# EAGLE schematic External Diagram FSAE 2021 (EAGLE 9.6.2)
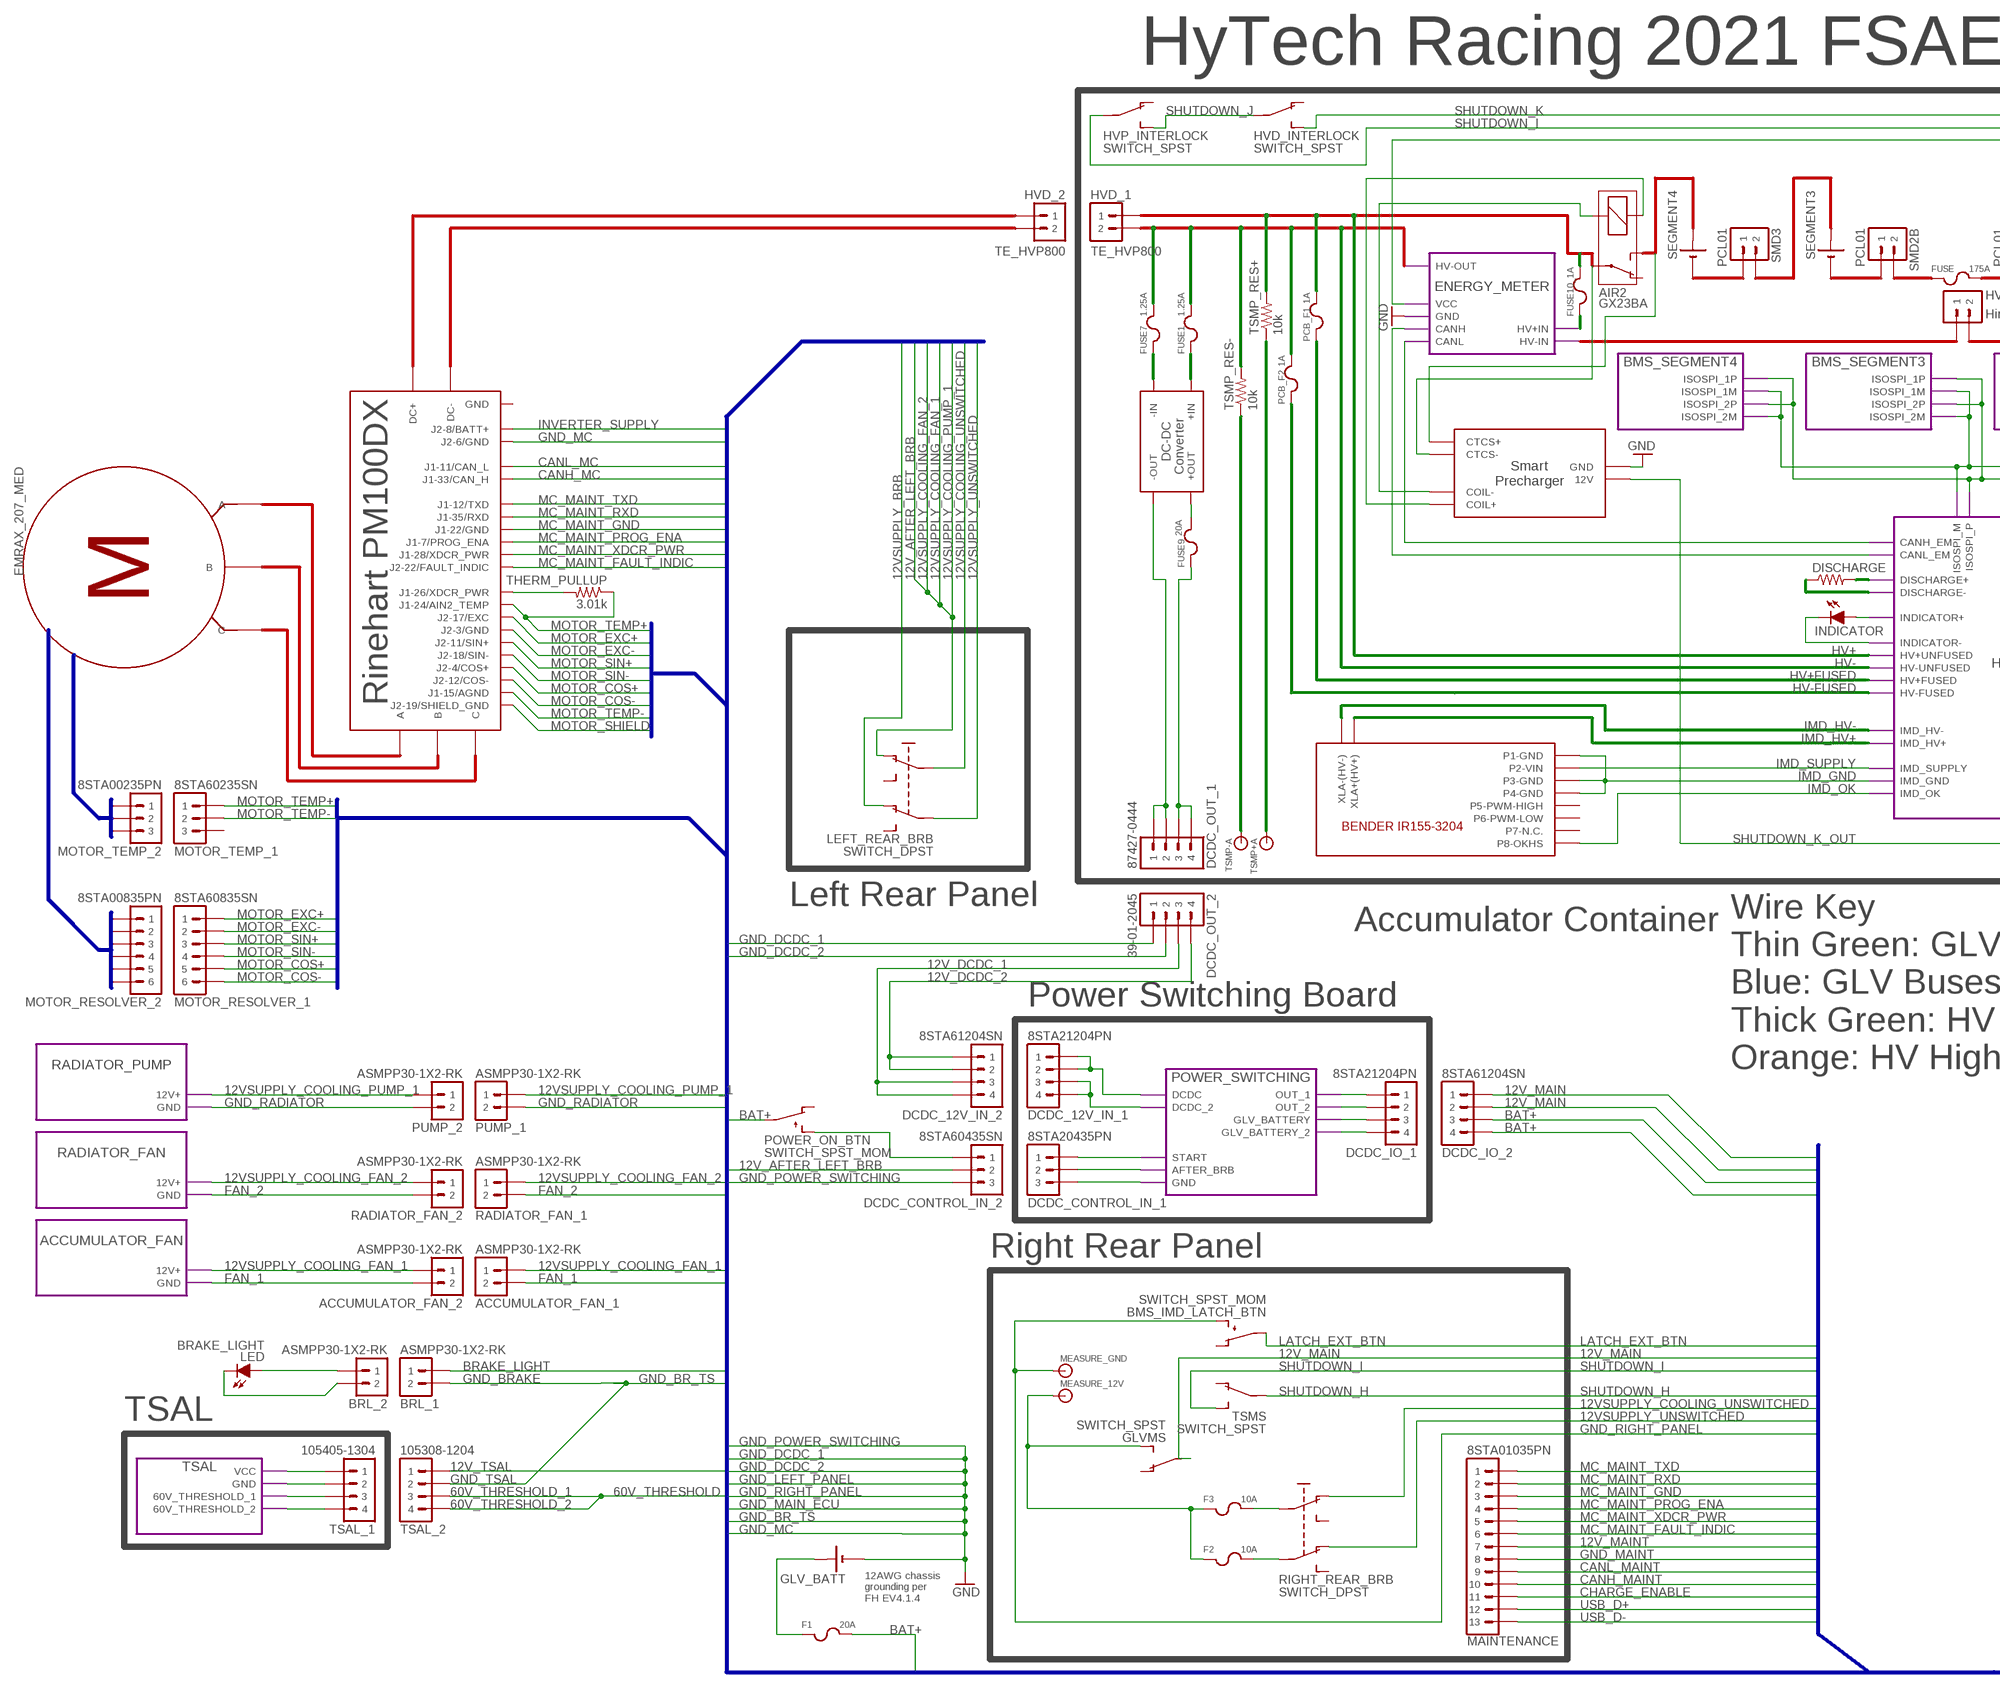
[diagram p0: schematic, sheet 1, part 1 of 2]
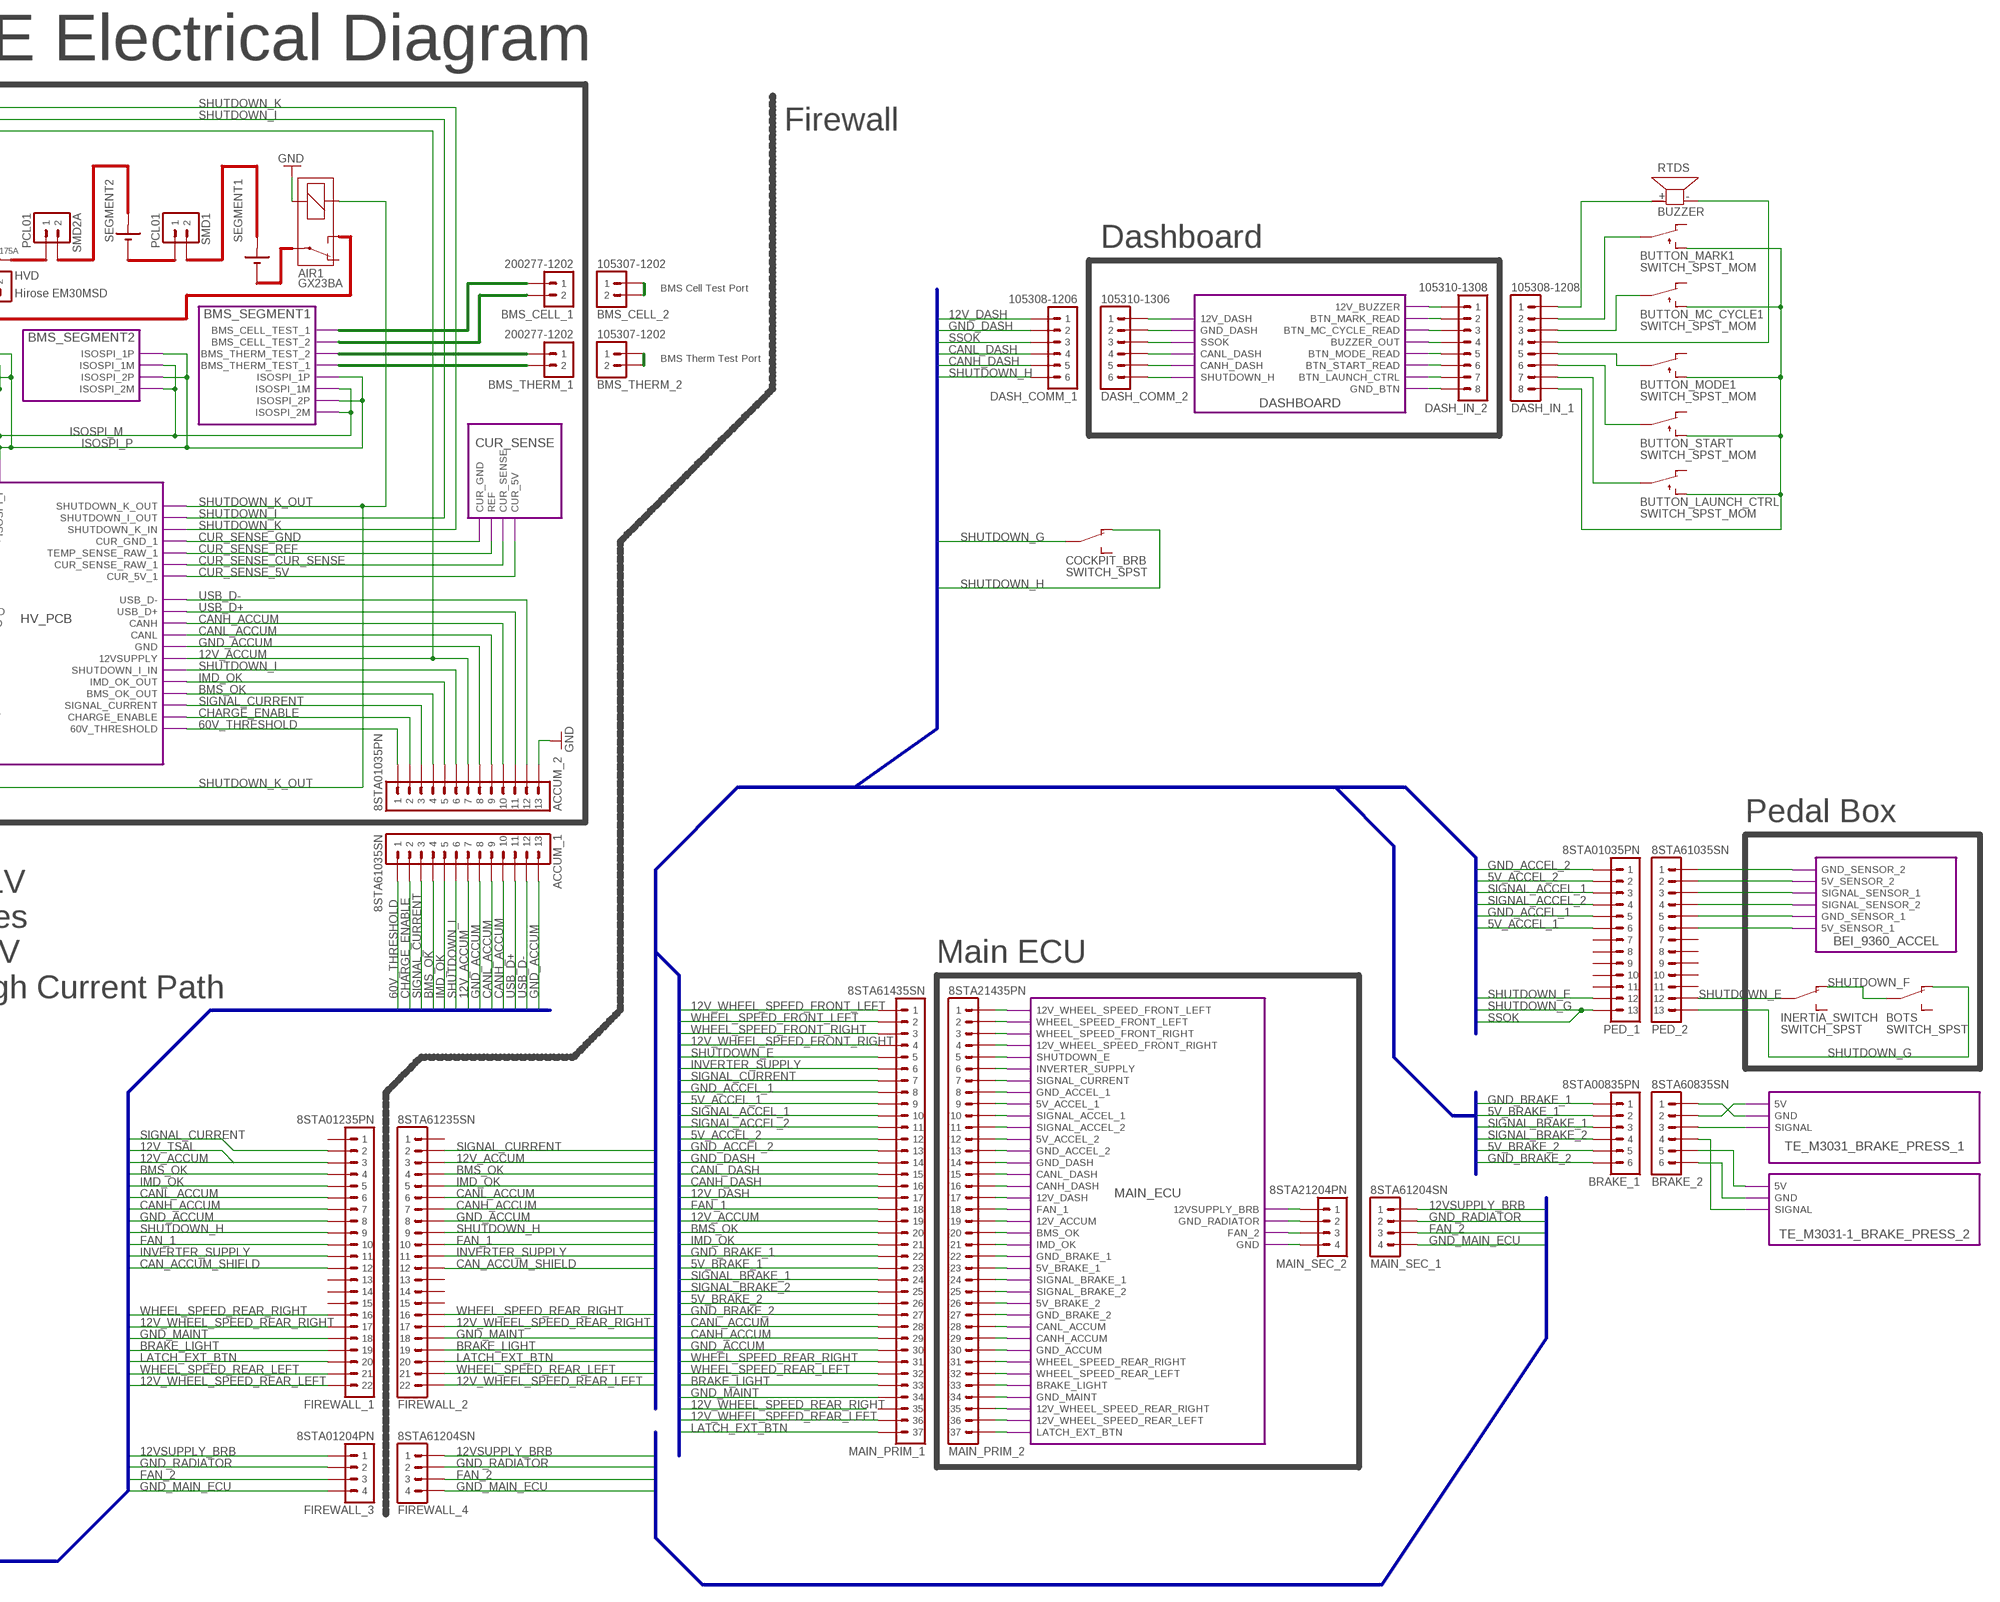
[diagram p1: schematic, sheet 1, part 2 of 2]

## Parts
ACCUM_1  8STA61035SN  M13  (no package)
ACCUM_2  8STA01035PN  M13  (no package)
ACCUMULATOR_FAN_1  ASMPP30-1X2-RK  M02  (no package)
ACCUMULATOR_FAN_2  ASMPP30-1X2-RK  M02  (no package)
AIR1  GX23BA  RELAY  (no package)
AIR2  GX23BA  RELAY  (no package)
BMS_CELL_1  200277-1202  M02  (no package)
BMS_CELL_2  105307-1202  M02  (no package)
BMS_IMD_LATCH_BTN  SWITCH_SPST_MOM  (no package)
BMS_THERM_1  200277-1202  M02  (no package)
BMS_THERM_2  105307-1202  M02  (no package)
BOTS  SWITCH_SPST  (no package)
BRAKE_1  8STA00835PN  M06  (no package)
BRAKE_2  8STA60835SN  M06  (no package)
BRAKE_LIGHT  LED  (no package)
BRL_1  ASMPP30-1X2-RK  M02  (no package)
BRL_2  ASMPP30-1X2-RK  M02  (no package)
BUTTON_LAUNCH_CTRL  SWITCH_SPST_MOM  (no package)
BUTTON_MARK1  SWITCH_SPST_MOM  (no package)
BUTTON_MC_CYCLE1  SWITCH_SPST_MOM  (no package)
BUTTON_MODE1  SWITCH_SPST_MOM  (no package)
BUTTON_START  SWITCH_SPST_MOM  (no package)
COCKPIT_BRB  SWITCH_SPST  (no package)
DASH_COMM_1  105308-1206  M06  (no package)
DASH_COMM_2  105310-1306  M06  (no package)
DASH_IN_1  105308-1208  M08  (no package)
DASH_IN_2  105310-1308  M08  (no package)
DCDC_12V_IN_1  8STA21204PN  M04  (no package)
DCDC_12V_IN_2  8STA61204SN  M04  (no package)
DCDC_CONTROL_IN_1  8STA20435PN  M03  (no package)
DCDC_CONTROL_IN_2  8STA60435SN  M03  (no package)
DCDC_IO_1  8STA21204PN  M04  (no package)
DCDC_IO_2  8STA61204SN  M04  (no package)
DCDC_OUT_1  87427-0444  M04  (no package)
DCDC_OUT_2  39-01-2045  M04  (no package)
DISCHARGE  RESISTOR10W  [10W_RESISTOR_VISHAY]
EMRAX_207_MED  MOTOR_AC  (no package)
F1  20A  FUSE  (no package)
F2  10A  FUSE  (no package)
F3  10A  FUSE  (no package)
FIREWALL_1  8STA01235PN  M22  (no package)
FIREWALL_2  8STA61235SN  M22  (no package)
FIREWALL_3  8STA01204PN  M04  (no package)
FIREWALL_4  8STA61204SN  M04  (no package)
FUSE  175A  FUSE  (no package)
FUSE1  1.25A  FUSE  (no package)
FUSE7  1.25A  FUSE  (no package)
FUSE9  20A  FUSE  (no package)
FUSE10_1A  FUSE  (no package)
GLV_BATT  BATTERY_1_CELL  (no package)
GLVMS  SWITCH_SPST  (no package)
HVD  Hirose EM30MSD  M02  (no package)
HVD_1  TE_HVP800  M02  (no package)
HVD_2  TE_HVP800  M02  (no package)
HVD_INTERLOCK  SWITCH_SPST  (no package)
HVP_INTERLOCK  SWITCH_SPST  (no package)
INDICATOR  INDICATOR  LED  (no package)
INERTIA_SWITCH  SWITCH_SPST  (no package)
LEFT_REAR_BRB  SWITCH_DPST  (no package)
MAIN_PRIM_1  8STA61435SN  M37  (no package)
MAIN_PRIM_2  8STA21435PN  M37  (no package)
MAIN_SEC_1  8STA61204SN  M04  (no package)
MAIN_SEC_2  8STA21204PN  M04  (no package)
MAINTENANCE  8STA01035PN  M13  (no package)
MEASURE_12V  BANANA_JACK  (no package)
MEASURE_GND  BANANA_JACK  (no package)
MOTOR_RESOLVER_1  8STA60835SN  M06  (no package)
MOTOR_RESOLVER_2  8STA00835PN  M06  (no package)
MOTOR_TEMP_1  8STA60235SN  M03  (no package)
MOTOR_TEMP_2  8STA00235PN  M03  (no package)
PCB_F1  1A  FUSE  (no package)
PCB_F2  1A  FUSE  (no package)
PED_1  8STA01035PN  M13  (no package)
PED_2  8STA61035SN  M13  (no package)
POWER_ON_BTN  SWITCH_SPST_MOM  (no package)
PUMP_1  ASMPP30-1X2-RK  M02  (no package)
PUMP_2  ASMPP30-1X2-RK  M02  (no package)
RADIATOR_FAN_1  ASMPP30-1X2-RK  M02  (no package)
RADIATOR_FAN_2  ASMPP30-1X2-RK  M02  (no package)
RIGHT_REAR_BRB  SWITCH_DPST  (no package)
RTDS  BUZZER  (no package)
SEGMENT1  BATTERY_1_CELL  (no package)
SEGMENT2  BATTERY_1_CELL  (no package)
SEGMENT3  BATTERY_1_CELL  (no package)
SEGMENT4  BATTERY_1_CELL  (no package)
SMD1  PCL01  M02  (no package)
SMD2A  PCL01  M02  (no package)
SMD2B  PCL01  M02  (no package)
SMD3  PCL01  M02  (no package)
THERM_PULLUP  3.01k  RESISTORAXIAL-0.3  [AXIAL-0.3]
TSAL_1  105405-1304  M04  (no package)
TSAL_2  105308-1204  M04  (no package)
TSMP+A  BANANA_JACK  (no package)
TSMP-A  BANANA_JACK  (no package)
TSMP_RES+  10k  RESISTOR10W  [10W_RESISTOR_VISHAY]
TSMP_RES-  10k  RESISTOR10W  [10W_RESISTOR_VISHAY]
TSMS  SWITCH_SPST  (no package)
U$1  RINEHART_PM100DX  (no package)
U$2  BENDER_IR155-3204  (no package)
U$3  SMART_PRECHARGER  (no package)
U$8  DC-DC_CONVERTER  (no package)

## Module instances
HV_PCB = HV_BOARD
BMS_SEGMENT2 = BMS_SEGMENT
BMS_SEGMENT3 = BMS_SEGMENT
BMS_SEGMENT4 = BMS_SEGMENT
RADIATOR_PUMP = COOLING_MODULE
RADIATOR_FAN = COOLING_MODULE
ACCUMULATOR_FAN = COOLING_MODULE
CUR_SENSE = CUR_SENSE
BMS_SEGMENT1 = BMS_SEGMENT_TEST
MAIN_ECU = MAIN_ECU
BEI_9360_ACCEL = BEI_9360
TE_M3031_BRAKE_PRESS_1 = TE_M3031
DASHBOARD = DASHBOARD
POWER_SWITCHING = POWER_SWITCHING
TE_M3031-1_BRAKE_PRESS_2 = TE_M3031
ENERGY_METER = ENERGY_METER
TSAL = TSAL

## Nets
5V_ACCEL_1: MAIN_PRIM_1.9 MAIN_PRIM_2.27 PED_1.6 PED_2.6 ; port MAIN_ECU.GND_BRAKE_2 BEI_9360_ACCEL.5V_SENSOR_1
5V_ACCEL_2: MAIN_PRIM_1.12 MAIN_PRIM_2.28 PED_1.2 PED_2.2 ; port MAIN_ECU.CANL_ACCUM BEI_9360_ACCEL.5V_SENSOR_2
5V_BRAKE: MAIN_PRIM_2.29 ; port MAIN_ECU.CANH_ACCUM
5V_BRAKE_1: BRAKE_1.2 MAIN_PRIM_1.23
5V_BRAKE_2: BRAKE_1.5 MAIN_PRIM_1.26
12V_ACCUM: ACCUM_1.7 ACCUM_2.7 FIREWALL_1.3 FIREWALL_2.3 MAIN_PRIM_1.19 MAIN_PRIM_2.10 ; port MAIN_ECU.SIGNAL_ACCEL_1 HV_PCB.12VSUPPLY ENERGY_METER.VCC
12V_AFTER_LEFT_BRB: DCDC_CONTROL_IN_2.2
12V_DASH: DASH_COMM_1.1 MAIN_PRIM_1.17 MAIN_PRIM_2.34 ; port MAIN_ECU.GND_MAINT
12V_DCDC_1: DCDC_12V_IN_2.3 DCDC_12V_IN_2.4 DCDC_OUT_2.3
12V_DCDC_2: DCDC_12V_IN_2.1 DCDC_12V_IN_2.2 DCDC_OUT_2.4
12V_MAIN: DCDC_IO_2.1 DCDC_IO_2.2 GLVMS.P
12V_MAINT: MAINTENANCE.7
12V_TSAL: TSAL_2.1
12V_WHEEL_SPEED_FRONT_LEFT: MAIN_PRIM_1.1
12V_WHEEL_SPEED_FRONT_RIGHT: MAIN_PRIM_1.4
12V_WHEEL_SPEED_REAR_LEFT: FIREWALL_1.22 FIREWALL_2.22 MAIN_PRIM_1.36
12V_WHEEL_SPEED_REAR_RIGHT: FIREWALL_1.17 FIREWALL_2.17
12VSUPPLY_BRB: FIREWALL_3.1 FIREWALL_4.1 LEFT_REAR_BRB.O1 MAIN_SEC_1.1 MAIN_SEC_2.1 ; port MAIN_ECU.12VSUPPLY_BRB
12VSUPPLY_COOLING_FAN_1: ACCUMULATOR_FAN_1.1 ACCUMULATOR_FAN_2.1 ; port ACCUMULATOR_FAN.12V+
12VSUPPLY_COOLING_FAN_2: RADIATOR_FAN_1.1 RADIATOR_FAN_2.1 ; port RADIATOR_FAN.12V+
12VSUPPLY_COOLING_PUMP_1: LEFT_REAR_BRB.O PUMP_1.1 PUMP_2.1 ; port RADIATOR_PUMP.12V+
12VSUPPLY_COOLING_UNSWITCHED: LEFT_REAR_BRB.P RIGHT_REAR_BRB.O
12VSUPPLY_UNSWITCHED: LEFT_REAR_BRB.P1 RIGHT_REAR_BRB.O1
60V_THRESHOLD: ACCUM_1.1 ACCUM_2.1 ; port HV_PCB.60V_THRESHOLD
60V_THRESHOLD_1: TSAL_2.3
60V_THRESHOLD_2: TSAL_2.4
BAT+: DCDC_IO_2.3 DCDC_IO_2.4 F1.2 POWER_ON_BTN.P
BMS_OK: ACCUM_1.4 ACCUM_2.4 FIREWALL_1.4 FIREWALL_2.4 MAIN_PRIM_1.20 ; port HV_PCB.BMS_OK_OUT
BRAKE_LIGHT: BRAKE_LIGHT.C BRL_1.1 BRL_2.2 FIREWALL_1.19 FIREWALL_2.19 MAIN_PRIM_1.33 MAIN_PRIM_2.9 MAIN_PRIM_2.33 ; port MAIN_ECU.5V_ACCEL_1 MAIN_ECU.BRAKE_LIGHT
CAN_ACCUM_SHIELD: FIREWALL_1.12 FIREWALL_2.12
CANH_ACCUM: ACCUM_1.10 ACCUM_2.10 FIREWALL_1.7 FIREWALL_2.7 MAIN_PRIM_1.29 MAIN_PRIM_2.13 ; port MAIN_ECU.GND_ACCEL_2 HV_PCB.CANH
CANH_DASH: DASH_COMM_1.5 MAIN_PRIM_1.16
CANH_MAINT: MAINTENANCE.10
CANH_MC: MAIN_PRIM_2.12 U$1.J1-33/CAN_H ; port MAIN_ECU.5V_ACCEL_2
CANL_ACCUM: ACCUM_1.9 ACCUM_2.9 FIREWALL_1.6 FIREWALL_2.6 MAIN_PRIM_1.28 MAIN_PRIM_2.26 ; port MAIN_ECU.5V_BRAKE_2 HV_PCB.CANL
CANL_DASH: DASH_COMM_1.4 MAIN_PRIM_1.15
CANL_MAINT: MAINTENANCE.9
CANL_MC: MAIN_PRIM_2.11 U$1.J1-11/CAN_L ; port MAIN_ECU.SIGNAL_ACCEL_2
CHARGE_ENABLE: ACCUM_1.2 ACCUM_2.2 MAINTENANCE.11 ; port HV_PCB.CHARGE_ENABLE
CUR_SENSE_5V: port CUR_SENSE.CUR_5V HV_PCB.CUR_5V_1
CUR_SENSE_CUR_SENSE: port CUR_SENSE.CUR_SENSE HV_PCB.CUR_SENSE_RAW_1
CUR_SENSE_GND: port CUR_SENSE.CUR_GND HV_PCB.CUR_GND_1
CUR_SENSE_REF: port CUR_SENSE.REF HV_PCB.TEMP_SENSE_RAW_1
DASH_1: MAIN_PRIM_2.1 ; port MAIN_ECU.12V_WHEEL_SPEED_FRONT_LEFT
DASH_4: MAIN_PRIM_2.4 ; port MAIN_ECU.12V_WHEEL_SPEED_FRONT_RIGHT
DASH_5: MAIN_PRIM_2.18 ; port MAIN_ECU.FAN_1
DASH_6: MAIN_PRIM_2.19 ; port MAIN_ECU.12V_ACCUM
DASH_8: MAIN_PRIM_2.21 ; port MAIN_ECU.IMD_OK
DASH_9: MAIN_PRIM_2.23 ; port MAIN_ECU.5V_BRAKE_1
DASH_11: MAIN_PRIM_2.6 ; port MAIN_ECU.INVERTER_SUPPLY
DASH_12: MAIN_PRIM_2.22 ; port MAIN_ECU.GND_BRAKE_1
FAN_1: ACCUMULATOR_FAN_1.2 ACCUMULATOR_FAN_2.2 FIREWALL_1.10 FIREWALL_2.10 MAIN_PRIM_1.18 ; port ACCUMULATOR_FAN.GND
FAN_2: FIREWALL_3.3 FIREWALL_4.3 MAIN_SEC_1.3 MAIN_SEC_2.3 RADIATOR_FAN_1.2 RADIATOR_FAN_2.2 ; port MAIN_ECU.FAN_2 RADIATOR_FAN.GND
GND: ACCUM_2.13 AIR1.2 MAIN_SEC_2.4 U$3.GND ; port MAIN_ECU.GND ENERGY_METER.GND
GND_ACCEL_1: MAIN_PRIM_1.8 MAIN_PRIM_2.14 PED_1.5 PED_2.5 ; port MAIN_ECU.GND_DASH BEI_9360_ACCEL.GND_SENSOR_1
GND_ACCEL_2: MAIN_PRIM_1.13 MAIN_PRIM_2.15 PED_1.1 PED_2.1 ; port MAIN_ECU.CANL_DASH BEI_9360_ACCEL.GND_SENSOR_2
GND_ACCUM: ACCUM_1.8 ACCUM_1.13 ACCUM_2.8 FIREWALL_1.8 FIREWALL_2.8 MAIN_PRIM_1.30 MAIN_PRIM_2.30 ; port MAIN_ECU.GND_ACCUM HV_PCB.GND
GND_AUX: MAIN_PRIM_2.36 ; port MAIN_ECU.12V_WHEEL_SPEED_REAR_LEFT
GND_BR: BRAKE_LIGHT.A BRL_2.1
GND_BRAKE: BRL_1.2 MAIN_PRIM_2.16 ; port MAIN_ECU.CANH_DASH
GND_BRAKE_1: BRAKE_1.1 MAIN_PRIM_1.22
GND_BRAKE_2: BRAKE_1.6 MAIN_PRIM_1.27
GND_CURRENT: MAIN_SEC_2.2 ; port MAIN_ECU.GND_RADIATOR
GND_DASH: DASH_COMM_1.2 MAIN_PRIM_1.14
GND_DCDC_1: DCDC_OUT_2.1
GND_DCDC_2: DCDC_OUT_2.2 GLV_BATT.- ; supply symbol labelled GND
GND_MAIN_ECU: FIREWALL_3.4 FIREWALL_4.4 MAIN_SEC_1.4
GND_MAINT: FIREWALL_1.18 FIREWALL_2.18 MAIN_PRIM_1.34 MAINTENANCE.8
GND_MC: U$1.J2-6/GND
GND_POWER_SWITCHING: DCDC_CONTROL_IN_2.3
GND_RADIATOR: FIREWALL_3.2 FIREWALL_4.2 MAIN_SEC_1.2 PUMP_1.2 PUMP_2.2 ; port RADIATOR_PUMP.GND
GND_RIGHT_PANEL: BMS_IMD_LATCH_BTN.S MEASURE_GND.1
GND_TSAL: TSAL_2.2
HV+: port HV_PCB.HV+UNFUSED
HV+FUSED: PCB_F1.1 ; port HV_PCB.HV+FUSED
HV-: port HV_PCB.HV-UNFUSED
HV-FUSED: PCB_F2.1 ; port HV_PCB.HV-FUSED
IMD_GND: U$2.P1-GND U$2.P3-GND U$2.P4-GND ; port HV_PCB.IMD_GND
IMD_HV+: U$2.XLA+(HV+) ; port HV_PCB.IMD_HV+
IMD_HV-: U$2.XLA-(HV-) ; port HV_PCB.IMD_HV-
IMD_OK: ACCUM_1.5 ACCUM_2.5 FIREWALL_1.5 FIREWALL_2.5 MAIN_PRIM_1.21 U$2.P8-OKHS ; port HV_PCB.IMD_OK HV_PCB.IMD_OK_OUT
IMD_SUPPLY: U$2.P2-VIN ; port HV_PCB.IMD_SUPPLY
INVERTER_SUPPLY: FIREWALL_1.11 FIREWALL_2.11 MAIN_PRIM_1.6 MAIN_PRIM_2.7 U$1.J2-8/BATT+ ; port MAIN_ECU.SIGNAL_CURRENT
ISOSPI_M: port HV_PCB.ISOSPI_M BMS_SEGMENT1.ISOSPI_1M BMS_SEGMENT2.ISOSPI_1M BMS_SEGMENT2.ISOSPI_2M BMS_SEGMENT3.ISOSPI_2M BMS_SEGMENT3.ISOSPI_1M BMS_SEGMENT4.ISOSPI_1M BMS_SEGMENT4.ISOSPI_2M BMS_SEGMENT1.ISOSPI_2M
ISOSPI_P: port HV_PCB.ISOSPI_P BMS_SEGMENT1.ISOSPI_1P BMS_SEGMENT2.ISOSPI_1P BMS_SEGMENT2.ISOSPI_2P BMS_SEGMENT3.ISOSPI_1P BMS_SEGMENT3.ISOSPI_2P BMS_SEGMENT4.ISOSPI_1P BMS_SEGMENT4.ISOSPI_2P BMS_SEGMENT1.ISOSPI_2P
LATCH_EXT_BTN: BMS_IMD_LATCH_BTN.P FIREWALL_1.20 FIREWALL_2.20 MAIN_PRIM_1.37 MAIN_PRIM_2.37 ; port MAIN_ECU.LATCH_EXT_BTN
MC_MAINT_FAULT_INDIC: MAINTENANCE.6 U$1.J2-22/FAULT_INDIC
MC_MAINT_GND: MAINTENANCE.3 U$1.J1-22/GND
MC_MAINT_PROG_ENA: MAINTENANCE.4 U$1.J1-7/PROG_ENA
MC_MAINT_RXD: MAINTENANCE.2 U$1.J1-35/RXD
MC_MAINT_TXD: MAINTENANCE.1 U$1.J1-12/TXD
MC_MAINT_XDCR_PWR: MAINTENANCE.5 U$1.J1-28/XDCR_PWR
MOTOR_COS+: MOTOR_RESOLVER_1.5 U$1.J2-4/COS+
MOTOR_COS-: MOTOR_RESOLVER_1.6 U$1.J2-12/COS-
MOTOR_EXC+: MOTOR_RESOLVER_1.1 U$1.J2-17/EXC
MOTOR_EXC-: MOTOR_RESOLVER_1.2 U$1.J2-3/GND
MOTOR_SHIELD: U$1.J2-19/SHIELD_GND
MOTOR_SIN+: MOTOR_RESOLVER_1.3 U$1.J2-11/SIN+
MOTOR_SIN-: MOTOR_RESOLVER_1.4 U$1.J2-18/SIN-
MOTOR_TEMP+: MOTOR_TEMP_1.1 THERM_PULLUP.P$1 U$1.J1-24/AIN2_TEMP
MOTOR_TEMP-: MOTOR_TEMP_1.2 U$1.J1-15/AGND
N$1: BUTTON_START.P DASH_IN_1.6
N$2: FUSE1.1 U$8.+IN
N$3: TSAL_1.1 ; port TSAL.VCC
N$4: TSAL_1.2 ; port TSAL.GND
N$5: FUSE1.2
N$7: F2.2 RIGHT_REAR_BRB.P1
N$9: FUSE7.2
N$10: BMS_CELL_2.1 BMS_CELL_2.2
N$11: BMS_CELL_1.1 ; port BMS_SEGMENT1.BMS_CELL_TEST_1
N$12: FUSE9.2 U$8.+OUT
N$13: DCDC_OUT_1.3 DCDC_OUT_1.4 FUSE9.1
N$14: DCDC_OUT_1.1 DCDC_OUT_1.2 U$8.-OUT
N$15: DASH_COMM_2.1 ; port DASHBOARD.12V_DASH
N$16: F3.2 RIGHT_REAR_BRB.P
N$17: THERM_PULLUP.P$2 U$1.J1-26/XDCR_PWR
N$18: DASH_COMM_2.2 ; port DASHBOARD.GND_DASH
N$19: DASH_COMM_2.3 ; port DASHBOARD.SSOK
N$20: TSMP-A.1 TSMP_RES-.1
N$21: DASH_COMM_2.4 ; port DASHBOARD.CANL_DASH
N$22: DASH_COMM_2.6 ; port DASHBOARD.SHUTDOWN_H
N$23: DASH_COMM_2.5 ; port DASHBOARD.CANH_DASH
N$24: DISCHARGE.1 ; port HV_PCB.DISCHARGE-
N$25: DISCHARGE.2 ; port HV_PCB.DISCHARGE+
N$26: DASH_IN_2.1 ; port DASHBOARD.12V_BUZZER
N$27: DASH_IN_2.2 ; port DASHBOARD.BTN_MARK_READ
N$28: DASH_IN_2.3 ; port DASHBOARD.BTN_MC_CYCLE_READ
N$29: DASH_IN_2.4 ; port DASHBOARD.BUZZER_OUT
N$30: DASH_IN_2.5 ; port DASHBOARD.BTN_MODE_READ
N$31: DASH_IN_2.6 ; port DASHBOARD.BTN_START_READ
N$32: DASH_IN_2.7 ; port DASHBOARD.BTN_LAUNCH_CTRL
N$33: DASH_IN_2.8 ; port DASHBOARD.GND_BTN
N$34: TSMP+A.1 TSMP_RES+.1
N$35: BMS_CELL_1.2 ; port BMS_SEGMENT1.BMS_CELL_TEST_2
N$37: BRAKE_2.2 ; port TE_M3031_BRAKE_PRESS_1.5V
N$38: FUSE7.1 U$8.-IN
N$39: TSMP_RES-.2
N$40: TSMP_RES+.2
N$41: BUTTON_MODE1.P DASH_IN_1.5
N$42: U$3.CTCS+
N$43: BUTTON_MC_CYCLE1.P DASH_IN_1.3
N$44: DASH_IN_1.1 RTDS.1
N$45: AIR2.2 U$3.COIL-
N$46: DASH_IN_1.4 RTDS.2
N$47: BUTTON_LAUNCH_CTRL.S BUTTON_MARK1.S BUTTON_MC_CYCLE1.S BUTTON_MODE1.S BUTTON_START.S DASH_IN_1.8
N$48: BUTTON_MARK1.P DASH_IN_1.2
N$49: BUTTON_LAUNCH_CTRL.P DASH_IN_1.7
N$50: BRAKE_2.1 ; port TE_M3031_BRAKE_PRESS_1.GND
N$51: PCB_F1.2
N$52: PCB_F2.2
N$53: BRAKE_2.3 ; port TE_M3031_BRAKE_PRESS_1.SIGNAL
N$54: DCDC_CONTROL_IN_2.1 POWER_ON_BTN.S
N$55: BRAKE_2.5 ; port TE_M3031-1_BRAKE_PRESS_2.5V
N$56: BRAKE_2.6 ; port TE_M3031-1_BRAKE_PRESS_2.GND
N$57: BRAKE_2.4 ; port TE_M3031-1_BRAKE_PRESS_2.SIGNAL
N$58: INDICATOR.A ; port HV_PCB.INDICATOR+
N$59: INDICATOR.C ; port HV_PCB.INDICATOR-
N$60: AIR2.P U$3.CTCS-
N$61: BMS_THERM_1.1 ; port BMS_SEGMENT1.BMS_THERM_TEST_2
N$62: BMS_THERM_1.2 ; port BMS_SEGMENT1.BMS_THERM_TEST_1
N$63: BMS_THERM_2.1 BMS_THERM_2.2
N$64: DCDC_12V_IN_1.3 DCDC_12V_IN_1.4 ; port POWER_SWITCHING.DCDC_2
N$65: DCDC_12V_IN_1.1 DCDC_12V_IN_1.2 ; port POWER_SWITCHING.DCDC
N$66: DCDC_IO_1.1 ; port POWER_SWITCHING.OUT_1
N$67: DCDC_IO_1.2 ; port POWER_SWITCHING.OUT_2
N$68: F1.1 GLV_BATT.+
N$69: DCDC_CONTROL_IN_1.3 ; port POWER_SWITCHING.GND
N$70: DCDC_CONTROL_IN_1.2 ; port POWER_SWITCHING.AFTER_BRB
N$71: DCDC_CONTROL_IN_1.1 ; port POWER_SWITCHING.START
N$72: AIR2.1 U$3.COIL+
N$73: DCDC_IO_1.3 ; port POWER_SWITCHING.GLV_BATTERY
N$74: F2.1 F3.1 GLVMS.S MEASURE_12V.1
N$75: FUSE10_1A.2
N$76: FUSE10_1A.1 ; port ENERGY_METER.HV+IN
N$77: MAIN_PRIM_2.35 ; port MAIN_ECU.12V_WHEEL_SPEED_REAR_RIGHT
N$78: port ENERGY_METER.CANL HV_PCB.CANH_EM
N$79: port ENERGY_METER.CANH HV_PCB.CANL_EM
N$80: DCDC_IO_1.4 ; port POWER_SWITCHING.GLV_BATTERY_2
N$81: TSAL_1.3 ; port TSAL.60V_THRESHOLD_1
N$82: TSAL_1.4 ; port TSAL.60V_THRESHOLD_2
RET_FAN_1: MAIN_PRIM_2.17 ; port MAIN_ECU.12V_DASH
SHUTDOWN_E: INERTIA_SWITCH.P MAIN_PRIM_1.5 MAIN_PRIM_2.5 PED_1.12 PED_2.12 ; port MAIN_ECU.SHUTDOWN_E
SHUTDOWN_F: BOTS.P INERTIA_SWITCH.O
SHUTDOWN_G: BOTS.O COCKPIT_BRB.P PED_1.13 PED_2.13
SHUTDOWN_H: COCKPIT_BRB.O DASH_COMM_1.6 FIREWALL_1.9 FIREWALL_2.9 TSMS.P
SHUTDOWN_I: ACCUM_1.6 ACCUM_2.6 HVP_INTERLOCK.P TSMS.S ; port HV_PCB.SHUTDOWN_I_IN HV_PCB.SHUTDOWN_I_OUT
SHUTDOWN_J: HVD_INTERLOCK.P HVP_INTERLOCK.S
SHUTDOWN_K: HVD_INTERLOCK.S ; port HV_PCB.SHUTDOWN_K_IN
SHUTDOWN_K_OUT: AIR1.1 U$3.12V ; port HV_PCB.SHUTDOWN_K_OUT
SIGNAL_ACCEL_1: MAIN_PRIM_1.10 PED_1.3
SIGNAL_ACCEL_2: MAIN_PRIM_1.11 PED_1.4
SIGNAL_BRAKE: MAIN_PRIM_2.8 ; port MAIN_ECU.GND_ACCEL_1
SIGNAL_BRAKE_1: BRAKE_1.3 MAIN_PRIM_1.24 MAIN_PRIM_2.24 PED_2.4 ; port MAIN_ECU.SIGNAL_BRAKE_1 BEI_9360_ACCEL.SIGNAL_SENSOR_2
SIGNAL_BRAKE_2: BRAKE_1.4 MAIN_PRIM_1.25 MAIN_PRIM_2.25 PED_2.3 ; port MAIN_ECU.SIGNAL_BRAKE_2 BEI_9360_ACCEL.SIGNAL_SENSOR_1
SIGNAL_CURRENT: ACCUM_1.3 ACCUM_2.3 FIREWALL_1.2 FIREWALL_2.2 MAIN_PRIM_1.7 ; port HV_PCB.SIGNAL_CURRENT
SSOK: DASH_COMM_1.3
USB_D+: ACCUM_1.11 ACCUM_2.11 MAINTENANCE.12 ; port HV_PCB.USB_D+
USB_D-: ACCUM_1.12 ACCUM_2.12 MAINTENANCE.13 ; port HV_PCB.USB_D-
WHEEL_SPEED_2: MAIN_PRIM_2.2 MAIN_PRIM_2.3 ; port MAIN_ECU.WHEEL_SPEED_FRONT_LEFT MAIN_ECU.WHEEL_SPEED_FRONT_RIGHT
WHEEL_SPEED_3: MAIN_PRIM_2.20 MAIN_PRIM_2.31 ; port MAIN_ECU.WHEEL_SPEED_REAR_RIGHT MAIN_ECU.BMS_OK
WHEEL_SPEED_4: MAIN_PRIM_2.32 ; port MAIN_ECU.WHEEL_SPEED_REAR_LEFT
WHEEL_SPEED_FRONT_LEFT: MAIN_PRIM_1.2
WHEEL_SPEED_FRONT_RIGHT: MAIN_PRIM_1.3
WHEEL_SPEED_REAR_LEFT: FIREWALL_1.21 FIREWALL_2.21 MAIN_PRIM_1.32
WHEEL_SPEED_REAR_RIGHT: FIREWALL_1.16 FIREWALL_2.16 MAIN_PRIM_1.31
Unconnected: AIR1.O AIR1.P AIR1.S AIR2.O AIR2.S BMS_IMD_LATCH_BTN.O BOTS.S BUTTON_LAUNCH_CTRL.O BUTTON_MARK1.O BUTTON_MC_CYCLE1.O BUTTON_MODE1.O BUTTON_START.O COCKPIT_BRB.S EMRAX_207_MED.A EMRAX_207_MED.B EMRAX_207_MED.C FIREWALL_1.1 FIREWALL_1.13 FIREWALL_1.14 FIREWALL_1.15 FIREWALL_2.1 FIREWALL_2.13 FIREWALL_2.14 FIREWALL_2.15 FUSE.1 FUSE.2 GLVMS.O HVD.1 HVD.2 HVD_1.1 HVD_1.2 HVD_2.1 HVD_2.2 HVD_INTERLOCK.O HVP_INTERLOCK.O INERTIA_SWITCH.S LEFT_REAR_BRB.S LEFT_REAR_BRB.S1 MAIN_PRIM_1.35 MOTOR_RESOLVER_2.1 MOTOR_RESOLVER_2.2 MOTOR_RESOLVER_2.3 MOTOR_RESOLVER_2.4 MOTOR_RESOLVER_2.5 MOTOR_RESOLVER_2.6 MOTOR_TEMP_1.3 MOTOR_TEMP_2.1 MOTOR_TEMP_2.2 MOTOR_TEMP_2.3 PED_1.7 PED_1.8 PED_1.9 PED_1.10 PED_1.11 PED_2.7 PED_2.8 PED_2.9 PED_2.10 PED_2.11 POWER_ON_BTN.O RIGHT_REAR_BRB.S RIGHT_REAR_BRB.S1 SEGMENT1.+ SEGMENT1.- SEGMENT2.+ SEGMENT2.- SEGMENT3.+ SEGMENT3.- SEGMENT4.+ SEGMENT4.- SMD1.1 SMD1.2 SMD2A.1 SMD2A.2 SMD2B.1 SMD2B.2 SMD3.1 SMD3.2 TSMS.O U$1.A U$1.B U$1.C U$1.DC+ U$1.DC- U$1.GND U$2.P5-PWM-HIGH U$2.P6-PWM-LOW U$2.P7-N.C.

## Buses
5V_ACCEL_1,5V_ACCEL_2,5V_BRAKE_1,5V_BRAKE_2,12V_ACCUM,12V_ACCUM_MAINT,12V_AFTER_LEFT_BRB,12V_DASH,12V_MAIN,12V_MAINT,12VSUPPLY_BRB,12VSUPPLY_COOLING_FAN_1,12VSUPPLY_COOLING_FAN_2,12VSUPPLY_COOLING_PUMP_1,12VSUPPLY_COOLING_UNSWITCHED,12VSUPPLY_UNSWITCHED,12V_TSAL,12V_WHEEL_SPEED_FRONT_LEFT,12V_WHEEL_SPEED_FRONT_RIGHT,12V_WHEEL_SPEED_REAR_LEFT,12V_WHEEL_SPEED_REAR_RIGHT,60V_THRESHOLD,BAT+,BMS_OK,CAN_ACCUM_SHIELD,CANH_ACCUM,CANH_DASH,CANH_FRONT,CANH_MAINT,CANH_MC,CANL_ACCUM,CANL_DASH,CANL_FRONT,CANL_MAINT,CANL_MC,CHARGE_ENABLE,DASH_1,DASH_4,DASH_5,DASH_8,DASH_9,DASH_12,FAN_1,FAN_2,GND_ACCEL_1,GND_ACCEL_2,GND_ACCUM,GND_ACCUM_RELAYS,GND_BRAKE,GND_BRAKE_1,GND_BRAKE_2,GND_BR_TS,GND_DASH,GND_DCDC_1,GND_DCDC_2,GND_LEFT_PANEL,GND_MAIN_ECU,GND_MAINT,GND_MC,GND_POWER_SWITCHING,GND_RADIATOR,GND_RIGHT_PANEL,GND_SHIELD,IMD_OK,INVERTER_SUPPLY,LATCH_EXT_BTN,MC_MAINT_FAULT_INDIC,MC_MAINT_GND,MC_MAINT_PROG_ENA,MC_MAINT_RXD,MC_MAINT_TXD,MC_MAINT_XDCR_PWR,MOTOR_COS+,MOTOR_COS-,MOTOR_EXC+,MOTOR_EXC-,MOTOR_SHIELD,MOTOR_SIN-,MOTOR_SIN+,MOTOR_TEMP+,MOTOR_TEMP-,SHUTDOWN_E,SHUTDOWN_F,SHUTDOWN_G,SHUTDOWN_I,SIGNAL_ACCEL_1,SIGNAL_ACCEL_2,SIGNAL_BRAKE,SIGNAL_BRAKE_1,SIGNAL_BRAKE_2,SIGNAL_CURRENT,SSOK,TSAL,USB_D+,USB_D-,WHEEL_SPEED_2,WHEEL_SPEED_3,WHEEL_SPEED_4,WHEEL_SPEED_FRONT_LEFT,WHEEL_SPEED_FRONT_RIGHT,WHEEL_SPEED_REAR_LEFT,WHEEL_SPEED_REAR_RIGHT
B$1
B$2
HT:5V_ACCEL_1,5V_ACCEL_2,5V_BRAKE,12V_ACCUM,12V_ACCUM_MAINT,12V_DASH,12V_MAINT,12VSUPPLY_BRB,12VSUPPLY_COOLING_FAN_1,12VSUPPLY_COOLING_FAN_2,12VSUPPLY_COOLING_PUMP_1,12VSUPPLY_COOLING_UNSWITCHED,12VSUPPLY_UNSWITCHED,BAT+,BRAKE_LIGHT,CANH_ACCUM,CANH_FRONT,CANH_MAINT,CANH_MC,CANL_ACCUM,CANL_FRONT,CANL_MAINT,CANL_MC,CHARGE_ENABLE,DASH_1,DASH_4,DASH_5,DASH_6,DASH_8,DASH_9,DASH_12,FAN_2,GND_ACCEL_1,GND_ACCEL_2,GND_ACCUM,GND_ACCUM_RELAYS,GND_BRAKE,GND_BR_TS,GND_CURRENT,GND_DASH,GND_LEFT_PANEL,GND_MAIN_ECU,GND_MAINT,GND_MC,GND_RIGHT_PANEL,GND_SHIELD,INVERTER_SUPPLY,LATCH_EXT_BTN,MC_MAINT_FAULT_INDIC,MC_MAINT_GND,MC_MAINT_PROG_ENA,MC_MAINT_RXD,MC_MAINT_TXD,MC_MAINT_XDCR_PWR,MOTOR_COS-,MOTOR_COS+,MOTOR_EXC-,MOTOR_EXC+,MOTOR_SHIELD,MOTOR_SIN+,MOTOR_SIN-,MOTOR_TEMP+,MOTOR_TEMP-,RET_FAN_1,SHUTDOWN_F,SHUTDOWN_G,SIGNAL_BRAKE,SIGNAL_BRAKE_1,SIGNAL_BRAKE_2,SSOK,TSAL,WHEEL_SPEED_2,WHEEL_SPEED_3,WHEEL_SPEED_4
HT1:5V_ACCEL_1,5V_BRAKE_2,12V_ACCUM,12V_ACCUM_MAINT,12V_DASH,12V_MAINT,12VSUPPLY_BRB,12VSUPPLY_COOLING_FAN_1,12VSUPPLY_COOLING_FAN_2,12VSUPPLY_COOLING_PUMP_1,12VSUPPLY_COOLING_UNSWITCHED,12VSUPPLY_UNSWITCHED,BAT+,BRAKE_LIGHT,CANH_ACCUM,CANH_FRONT,CANH_MAINT,CANH_MC,CANL_ACCUM,CANL_FRONT,CANL_MAINT,CANL_MC,CHARGE_ENABLE,DASH_1,DASH_4,DASH_5,DASH_8,DASH_9,DASH_12,FAN_2,GND_ACCEL_2,GND_ACCUM,GND_ACCUM_RELAYS,GND_BRAKE,GND_BR_TS,GND_CURRENT,GND_DASH,GND_LEFT_PANEL,GND_MAIN_ECU,GND_MAINT,GND_MC,GND_RADIATOR,GND_RIGHT_PANEL,GND_SHIELD,INVERTER_SUPPLY,LATCH_EXT_BTN,MC_MAINT_FAULT_INDIC,MC_MAINT_GND,MC_MAINT_PROG_ENA,MC_MAINT_RXD,MC_MAINT_TXD,MC_MAINT_XDCR_PWR,MOTOR_COS-,MOTOR_COS+,MOTOR_EXC+,MOTOR_EXC-,MOTOR_SHIELD,MOTOR_SIN+,MOTOR_SIN-,MOTOR_TEMP+,MOTOR_TEMP-,SHUTDOWN_F,SHUTDOWN_G,SIGNAL_BRAKE,SIGNAL_BRAKE_1,SIGNAL_BRAKE_2,SSOK,TSAL,WHEEL_SPEED_2,WHEEL_SPEED_3,WHEEL_SPEED_4

## Notes on the sheet
- HyTech Racing 2021 FSAE Electrical Diagram
- Firewall
- Dashboard
- ⬅ BMS Cell Test Port
- ⬅ BMS Therm Test Port
- Left Rear Panel | Pedal Box
- Accumulator Container
- Power Switching Board
- Main ECU
- Wire Key
  Thin Green: GLV
  Blue: GLV Buses
  Thick Green: HV
  Orange: HV High Current Path
- Right Rear Panel
- TSAL
- 12AWG chassis
  grounding per
  FH EV4.1.4

## Library data of the parts
ACCUM_1 ACCUM_2 MAINTENANCE PED_1 PED_2 = HyTechSymbols:M13: Generic 13-pin connector
ACCUMULATOR_FAN_1 ACCUMULATOR_FAN_2 BMS_CELL_1 BMS_CELL_2 BMS_THERM_1 BMS_THERM_2 BRL_1 BRL_2 HVD HVD_1 HVD_2 PUMP_1 PUMP_2 RADIATOR_FAN_1 RADIATOR_FAN_2 SMD1 SMD2A SMD2B SMD3 = HyTechSymbols:M02: Generic 2-pin connector
AIR1 AIR2 = HyTechSymbols:RELAY: RELAY 1 x switch
BMS_IMD_LATCH_BTN BUTTON_LAUNCH_CTRL BUTTON_MARK1 BUTTON_MC_CYCLE1 BUTTON_MODE1 BUTTON_START POWER_ON_BTN = HyTechSymbols:SWITCH_SPST_MOM: Single Pull Single Throw Switch Momentary
BOTS COCKPIT_BRB GLVMS HVD_INTERLOCK HVP_INTERLOCK INERTIA_SWITCH TSMS = HyTechSymbols:SWITCH_SPST: Single Pull Single Throw Switch
BRAKE_1 BRAKE_2 DASH_COMM_1 DASH_COMM_2 MOTOR_RESOLVER_1 MOTOR_RESOLVER_2 = HyTechSymbols:M06: Generic 6-pin connector
BRAKE_LIGHT INDICATOR = HyTechSymbols:LED: Generic LED
DASH_IN_1 DASH_IN_2 = HyTechSymbols:M08: Generic 8-pin connector
DCDC_12V_IN_1 DCDC_12V_IN_2 DCDC_IO_1 DCDC_IO_2 DCDC_OUT_1 DCDC_OUT_2 FIREWALL_3 FIREWALL_4 MAIN_SEC_1 MAIN_SEC_2 TSAL_1 TSAL_2 = HyTechSymbols:M04: Generic 4-pin connector
DCDC_CONTROL_IN_1 DCDC_CONTROL_IN_2 MOTOR_TEMP_1 MOTOR_TEMP_2 = HyTechSymbols:M03: Generic 3-pin connector
DISCHARGE THERM_PULLUP TSMP_RES+ TSMP_RES- = HyTechDevices:RESISTOR: Resistor Basic schematic elements and footprints for 0603, 1206, and PTH resistors.
EMRAX_207_MED = HyTechSymbols:MOTOR_AC: Generic three-phase AC electric motor
F1-F3 FUSE FUSE1 FUSE7 FUSE9 FUSE10_1A PCB_F1 PCB_F2 = HyTechSymbols:FUSE: Generic Fuse
FIREWALL_1 FIREWALL_2 = HyTechSymbols:M22: Generic 22-pin connector
GLV_BATT SEGMENT1-SEGMENT4 = HyTechSymbols:BATTERY_1_CELL: Generic 1-cell battery Source: Sonnenschein
LEFT_REAR_BRB RIGHT_REAR_BRB = HyTechSymbols:SWITCH_DPST: Double Pull Single Throw Switch
MAIN_PRIM_1 MAIN_PRIM_2 = HyTechSymbols:M37: Generic 37-pin connector
MEASURE_12V MEASURE_GND TSMP+A TSMP-A = HyTechSymbols:BANANA_JACK: Banana Jack Purchasing: Mouser - Red <http://www.mouser.com/ProductDetail/Pomona-Electronics/72930-2/?qs=2nDnb8a6ouM2t6dPw1JBow%3D%3D> Mouser - Black <http://www.mouser.com/ProductDetail/Pomona-Electronics/72930-0/?qs=2nDnb8a6ouNpA2wl9kKnzA%3D%3D>
RTDS = HyTechSymbols:BUZZER: SPEAKER Prouct Page <http://www.alliedelec.com/icc-intervox-brp4535s-12-c/70115826/> (Ready to Drive Sound) Source: Schukat
U$1 = HyTechSymbols:RINEHART_PM100DX: Rinehart Motion Systems PM100DX Motor Inverter Product Page <http://www.rinehartmotion.com/standard.html> Datasheet <http://www.rinehartmotion.com/uploads/5/1/3/0/51309945/pm100-150datasheet_2.pdf>
U$2 = HyTechSymbols:BENDER_IR155-3204: Bender IR155-3204 Insulation Monitoring Device Datasheet <http://www.bender-es.com/fileadmin/products/doc/IR155-32xx-V004_D00115_D_XXEN.pdf>
U$3 = HyTechSymbols:SMART_PRECHARGER: Smart Precharger http://www.zeva.com.au/Products/datasheets/SmartPrechargerV1-3.pdf
U$8 = HyTechSymbols:DC-DC_CONVERTER

## Module HV_BOARD
Ports: 60V_THRESHOLD(out) IMD_SUPPLY(pwr) IMD_GND(pwr) IMD_HV+(nc) IMD_HV-(nc) HV+UNFUSED(pwr) HV-UNFUSED(pwr) 12VSUPPLY(pwr) BMS_OK_OUT(out) HV+FUSED(pwr) HV-FUSED(pwr) SHUTDOWN_K_OUT(out) SHUTDOWN_K_IN(in) SHUTDOWN_I_OUT(out) IMD_OK(in) IMD_OK_OUT(out) CHARGE_ENABLE(out) DISCHARGE+(out) DISCHARGE-(in) ISOSPI_P(io) ISOSPI_M(io) CUR_5V_1(pwr) CUR_SENSE_RAW_1(in) TEMP_SENSE_RAW_1(in) CUR_GND_1(pwr) GND(pwr) SIGNAL_CURRENT(out) SHUTDOWN_I_IN(in) CANH(io) CANL(io) INDICATOR+(out) INDICATOR-(in) USB_D+(io) USB_D-(io) CANL_EM(io) CANH_EM(io)

### Library data of the parts

## Module BMS_SEGMENT
Ports: ISOSPI_1M(io) ISOSPI_1P(io) ISOSPI_2P(io) ISOSPI_2M(io)

### Library data of the parts

## Module ENERGY_METER
Ports: HV+IN(in) HV-OUT(in) HV-IN(out) VCC(pwr) GND(pwr) CANH(io) CANL(io)

### Library data of the parts

## Module CUR_SENSE
Ports: CUR_GND(pwr) CUR_SENSE(out) REF(out) CUR_5V(pwr)

### Library data of the parts

## Module COOLING_MODULE
Ports: 12V+(in) GND(out)

### Library data of the parts

## Module BMS_SEGMENT_TEST
Ports: BMS_CELL_TEST_1(out) BMS_CELL_TEST_2(in) ISOSPI_1M(io) ISOSPI_1P(io) ISOSPI_2P(io) ISOSPI_2M(io) BMS_THERM_TEST_1(io) BMS_THERM_TEST_2(io)

### Library data of the parts

## Module MAIN_ECU
Ports: 12V_WHEEL_SPEED_FRONT_LEFT(pwr) WHEEL_SPEED_FRONT_LEFT(in) WHEEL_SPEED_FRONT_RIGHT(in) 12V_WHEEL_SPEED_FRONT_RIGHT(pwr) SHUTDOWN_E(out) INVERTER_SUPPLY(out) SIGNAL_CURRENT(in) GND_ACCEL_1(pwr) 5V_ACCEL_1(pwr) 12VSUPPLY_BRB(pwr) SIGNAL_ACCEL_2(in) 5V_ACCEL_2(pwr) GND_ACCEL_2(pwr) GND_DASH(pwr) CANL_DASH(io) CANH_DASH(io) 12V_DASH(in) FAN_1(out) 12V_ACCUM(pwr) BMS_OK(in) IMD_OK(in) GND_BRAKE_1(pwr) 5V_BRAKE_1(pwr) SIGNAL_BRAKE_1(in) SIGNAL_BRAKE_2(in) 5V_BRAKE_2(pwr) GND_BRAKE_2(pwr) CANL_ACCUM(io) CANH_ACCUM(io) GND_ACCUM(pwr) WHEEL_SPEED_REAR_RIGHT(in) WHEEL_SPEED_REAR_LEFT(in) BRAKE_LIGHT(out) GND_MAINT(pwr) 12V_WHEEL_SPEED_REAR_RIGHT(pwr) 12V_WHEEL_SPEED_REAR_LEFT(pwr) LATCH_EXT_BTN(in) GND(pwr) SIGNAL_ACCEL_1(in) GND_RADIATOR(pwr) FAN_2(out)

### Library data of the parts

## Module BEI_9360
Ports: GND_SENSOR_2(pwr) GND_SENSOR_1(pwr) SIGNAL_SENSOR_1(out) SIGNAL_SENSOR_2(out) 5V_SENSOR_2(pwr) 5V_SENSOR_1(pwr)

### Library data of the parts

## Module TE_M3031
Ports: 5V(pwr) GND(pwr) SIGNAL(out)

### Library data of the parts

## Module DASHBOARD
Ports: 12V_DASH(pwr) GND_DASH(pwr) SSOK(in) CANL_DASH(io) CANH_DASH(io) SHUTDOWN_H(in) 12V_BUZZER(pwr) BTN_MARK_READ(in) BTN_MC_CYCLE_READ(in) BUZZER_OUT(out) BTN_MODE_READ(in) BTN_START_READ(in) BTN_LAUNCH_CTRL(in) GND_BTN(pwr)

### Library data of the parts

## Module POWER_SWITCHING
Ports: OUT_1(out) OUT_2(out) GLV_BATTERY(in) GLV_BATTERY_2(in) DCDC(in) DCDC_2(in) START(in) AFTER_BRB(in) GND(pwr)

### Library data of the parts

## Module TSAL
Ports: VCC(io) GND(io) 60V_THRESHOLD_1(io) 60V_THRESHOLD_2(io)

### Library data of the parts